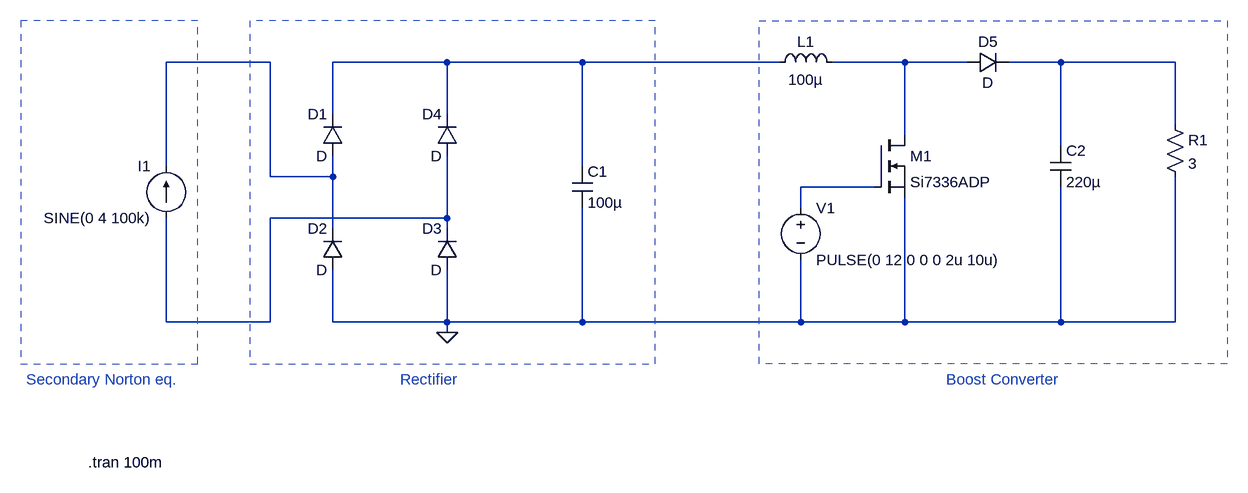
[diagram p0: schematic Rectifier and boost.asc]
Rectifier and boost.asc, the LTspice schematic file:
Version 4
SHEET 1 1892 680
WIRE 272 -32 112 -32
WIRE 544 -32 368 -32
WIRE 752 -32 544 -32
WIRE 1056 -32 752 -32
WIRE 1248 -32 1136 -32
WIRE 1344 -32 1248 -32
WIRE 1488 -32 1408 -32
WIRE 1664 -32 1488 -32
WIRE 368 48 368 -32
WIRE 544 48 544 -32
WIRE 1664 64 1664 -32
WIRE 1248 80 1248 -32
WIRE 1488 96 1488 -32
WIRE 112 128 112 -32
WIRE 752 128 752 -32
WIRE 272 144 272 -32
WIRE 368 144 368 112
WIRE 368 144 272 144
WIRE 1200 160 1088 160
WIRE 1088 192 1088 160
WIRE 544 208 544 112
WIRE 544 208 272 208
WIRE 368 224 368 144
WIRE 544 224 544 208
WIRE 112 368 112 208
WIRE 272 368 272 208
WIRE 272 368 112 368
WIRE 368 368 368 288
WIRE 544 368 544 288
WIRE 544 368 368 368
WIRE 752 368 752 192
WIRE 752 368 544 368
WIRE 1088 368 1088 272
WIRE 1088 368 752 368
WIRE 1248 368 1248 176
WIRE 1248 368 1088 368
WIRE 1488 368 1488 160
WIRE 1488 368 1248 368
WIRE 1664 368 1664 144
WIRE 1664 368 1488 368
WIRE 544 384 544 368
FLAG 544 384 0
SYMBOL current 112 208 R180
WINDOW 0 24 80 Left 2
WINDOW 3 24 0 Left 2
WINDOW 123 0 0 Left 0
WINDOW 39 0 0 Left 0
SYMATTR InstName I1
SYMATTR Value SINE(0 4 100k)
SYMBOL diode 384 112 R180
WINDOW 0 24 64 Left 2
WINDOW 3 24 0 Left 2
SYMATTR InstName D1
SYMBOL diode 384 288 R180
WINDOW 0 24 64 Left 2
WINDOW 3 24 0 Left 2
SYMATTR InstName D2
SYMBOL diode 560 288 R180
WINDOW 0 24 64 Left 2
WINDOW 3 24 0 Left 2
SYMATTR InstName D3
SYMBOL diode 560 112 R180
WINDOW 0 24 64 Left 2
WINDOW 3 24 0 Left 2
SYMATTR InstName D4
SYMBOL cap 736 128 R0
SYMATTR InstName C1
SYMATTR Value 100µ
SYMBOL ind 1040 -16 R270
WINDOW 0 32 56 VTop 2
WINDOW 3 5 56 VBottom 2
SYMATTR InstName L1
SYMATTR Value 100µ
SYMBOL nmos 1200 80 R0
SYMATTR InstName M1
SYMATTR Value Si7336ADP
SYMBOL voltage 1088 176 R0
WINDOW 123 0 0 Left 0
WINDOW 39 0 0 Left 0
SYMATTR InstName V1
SYMATTR Value PULSE(0 12 0 0 0 2u 10u)
SYMBOL diode 1344 -16 R270
WINDOW 0 32 32 VTop 2
WINDOW 3 0 32 VBottom 2
SYMATTR InstName D5
SYMBOL cap 1472 96 R0
SYMATTR InstName C2
SYMATTR Value 220µ
SYMBOL res 1648 48 R0
SYMATTR InstName R1
SYMATTR Value 3
TEXT -8 584 Left 2 !.tran 100m
TEXT 472 456 Left 2 ;Rectifier
TEXT 1312 456 Left 2 ;Boost Converter
TEXT -104 456 Left 2 ;Secondary Norton eq.
RECTANGLE Normal 1744 432 1024 -96 2
RECTANGLE Normal 240 432 864 -96 2
RECTANGLE Normal -112 432 160 -96 2

The netlist it stands for:
* Rectifier and boost.asc
I1 N006 N001 SINE(0 4 100k)
D1 N001 N002 D
D2 0 N001 D
D3 0 N006 D
D4 N006 N002 D
C1 N002 0 100µ
L1 N002 N003 100µ
M1 N003 N005 0 0 Si7336ADP
V1 N005 0 PULSE(0 12 0 0 0 2u 10u)
D5 N003 N004 D
C2 N004 0 220µ
R1 N004 0 3
.model D D
.lib standard.dio
.model NMOS NMOS
.model PMOS PMOS
.lib standard.mos
.tran 100m
* Rectifier
* Boost Converter
* Secondary Norton eq.
.backanno
.end